# Altium schematic sheet MotorShield.SchDoc
size A; SheetNumber: 8; SheetTotal: 10
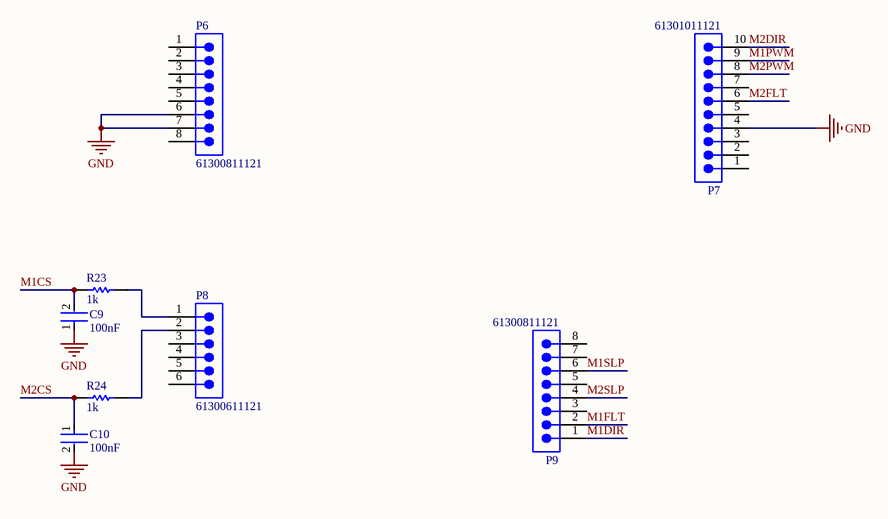
[diagram p0: MotorShield.SchDoc]

## Parts
C9  100nF  [FP-0402B104K160CT-IPC_C]
C10  100nF  [FP-0402B104K160CT-IPC_C]
P6  61300811121  [61300811121]
P7  61301011121  [61301011121]
P8  61300611121  [61300611121]
P9  61300811121  [61300811121]
R23  1k  [RESC1005X40X25NL05T05]
R24  1k  [RESC1005X40X25NL05T05]

## Nets
GND: C9.1 C10.2 P6.6 P6.7 P7.4
M1CS: C9.2 R23.1
M1DIR: P9.1
M1FLT: P9.2
M1PWM: P7.9
M1SLP: P9.6
M2CS: C10.1 R24.1
M2DIR: P7.10
M2FLT: P7.6
M2PWM: P7.8
M2SLP: P9.4
NetP8_1: P8.1 R23.2
NetP8_2: P8.2 R24.2

Not connected (* = marked no-connect by the designer): P6 1 2 3 4 5 8; P7 1 2 3 5 7; P8 3 4 5 6; P9 3 5 7 8

## Library data of the parts
C9 C10 = CMP-45632-000002-1: CAP CER 0.1UF 16V X7R 0402; Tolerance: 10%; Case Code (Imperial): 0402; Length: 1mm; Radiation Hardening: No; Case Code (Metric): 1005; Max Operating Temperature: 125°C; Voltage Rating: 16V; Capacitance: 100nF; Voltage Rating (DC): 16V; Dielectric: X7R; RoHS Compliant: Yes; Packaging: Tape and Reel; Lead Free: Lead Free; Depth: 0.5mm; Case/Package: 0402; Min Operating Temperature: -55°C; Series: -
P6 P9 = CMP-1502-01076-4: THT Vertical Pin Header WR-PHD, Pitch 2.54 mm, Single Row, 8 pins; Pitch: 2.54mm; Voltage Rating: 250V; Connector Type: Male Pin; Current Rating: 3A; Contact Resistance: 20mΩ; Number of Positions: 8; Gender: Male; Contact Mating Length: 5.9944mm; Orientation: Vertical; Contact Plating: Gold; Mount: Through Hole; Min Operating Temperature: -40°C; Packaging: Bulk; Height: 8.54mm; Number of Pins: 8; Contact Material: Gold; Operating Supply Voltage: 250V; Termination: Solder; RoHS: Compliant; Color: Black; Number of Contacts: 8; Lead Pitch: 2.54mm; Number of Rows: 1; Max Operating Temperature: 105°C
P7 = CMP-1502-01082-6: THT Vertical Pin Header WR-PHD, Pitch 2.54 mm, Single Row, 10 pins; Gender: Male; Voltage Rating: 250V; Connector Type: Male Pin; Current Rating: 3A; Number of Contacts: 10; Pitch: 2.54mm; Contact Resistance: 20mΩ; Insulation Resistance: 1GΩ; RoHS: Compliant; Length: 2.54mm; Max Operating Temperature: 105°C; Flammability Rating: UL94 V-0; Width: 25.4mm; Number of Positions: 10; Number of Rows: 1; Lead Pitch: 2.54mm; Number of Pins: 10; Termination: Solder; Operating Supply Voltage: 250V; Color: Black; Housing Material: PBT; Orientation: Vertical; Packaging: Bulk; Mount: Through Hole; Contact Mating Length: 5.9944mm; Contact Material: Gold; Height: 8.74mm; Min Operating Temperature: -40°C; Contact Plating: Gold; Contact Gender: Male
P8 = CMP-1502-01070-4: THT Vertical Pin Header WR-PHD, Pitch 2.54 mm, Single Row, 6 pins; Pitch: 2.54mm; Operating Supply Voltage: 250V; Connector Type: Male Pin; Gender: Male; Number of Positions: 6; Contact Resistance: 20mΩ; Current Rating: 3A; Termination: Through Hole; Color: Black; Number of Pins: 6; Lead Pitch: 2.54mm; Height: 8.89mm; RoHS: Compliant; Lead Free: Lead Free; Contact Mating Length: 5.9944mm; Contact Plating: Gold; Contact Gender: Male; Packaging: Bulk; Orientation: Vertical; Mount: Through Hole; Voltage Rating: 250V; Number of Rows: 1; Max Operating Temperature: 105°C; Min Operating Temperature: -40°C; Housing Material: PBT; Contact Material: Gold; Number of Contacts: 6
R23 R24 = CMP-1011-00510-4: Chip Resistor, 1 KOhm, +/- 1%, 100 mW, -55 to 155 degC, 0402 (1005 Metric), RoHS, Tape and Reel; PartNumber: ERJ-2RKF1001X; Manufacturer: Basic Passives; Voltage Rating: 50 V; Case\/Package: 0402; Resistance: 1 KOhm; Power Rating: 100 mW; DatasheetVersion: 04/2015; Radiation Hardening: No; Pins: 2; Height: 0.35 mm; RoHSCompliant: true; Case Code (Imperial): 0402; ComponentLink2Description: Datasheet; ComponentLink1Description: Manufacturer URL; PackageReference: 0402; Mount: Surface Mount; Package Quantity: 10000; Tolerance: 1%; ComponentLink1URL: http://www.panasonic.com/; PackageDescription: 2-Pin Surface Mount Device, Body 1 x 0.5 mm; Mounting Technology: Surface Mount; Case Code (Metric): 1005; ComponentLink2URL: http://industrial.panasonic.com/cdbs/www-data/pdf/RDA0000/AOA0000C86.pdf; REACH SVHC: Yes; Packaging: Tape and Reel; Max Operating Temperature: 155 degC; Min Operating Temperature: -55 degC; Width: 0.5 mm; Length: 1 mm